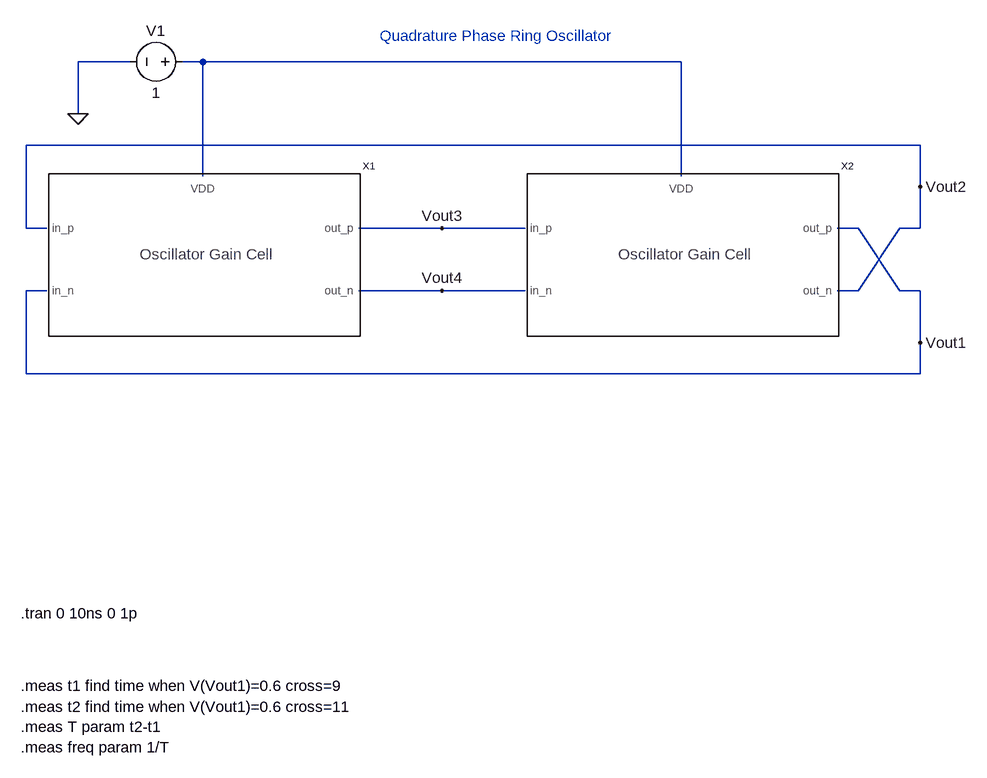
[diagram p0: schematic quadrature_phase_ring_oscillator.asc]
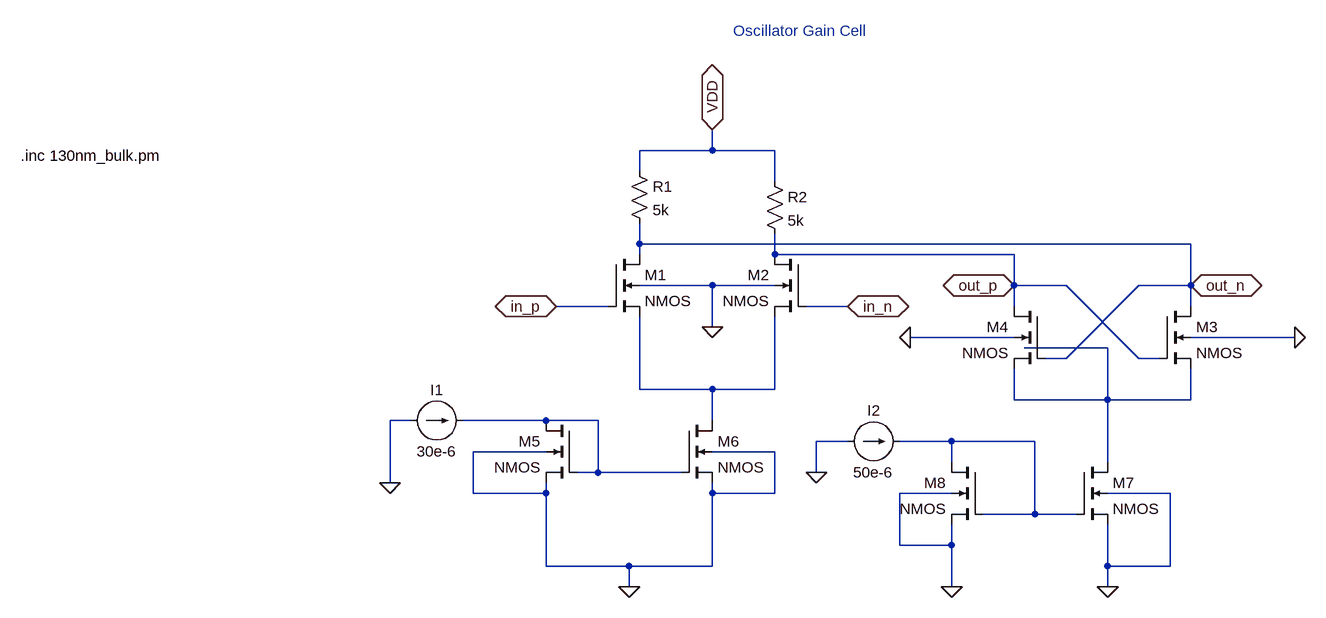
[diagram p1: sub-circuit osc_gain_cell.asc]
quadrature_phase_ring_oscillator.asc, the LTspice schematic file:
Version 4
SHEET 1 1172 1032
WIRE -96 -32 -176 -32
WIRE 16 -32 -16 -32
WIRE 752 -32 16 -32
WIRE -176 48 -176 -32
WIRE 1120 96 -256 96
WIRE 16 144 16 -32
WIRE 752 144 752 -32
WIRE 1120 160 1120 96
WIRE -256 224 -256 96
WIRE -224 224 -256 224
WIRE 384 224 256 224
WIRE 512 224 384 224
WIRE 1024 224 992 224
WIRE 1120 224 1120 160
WIRE 1120 224 1088 224
WIRE -224 320 -256 320
WIRE 384 320 256 320
WIRE 512 320 384 320
WIRE 1024 320 1088 224
WIRE 1024 320 992 320
WIRE 1088 320 1024 224
WIRE 1120 320 1088 320
WIRE 1120 400 1120 320
WIRE -256 448 -256 320
WIRE 1120 448 1120 400
WIRE 1120 448 -256 448
FLAG -176 48 0
FLAG 384 224 Vout3
FLAG 384 320 Vout4
FLAG 1120 400 Vout1
FLAG 1120 160 Vout2
SYMBOL osc_gain_cell -288 208 R0
SYMATTR InstName X1
SYMBOL osc_gain_cell 448 208 R0
SYMATTR InstName X2
SYMBOL voltage 0 -32 R90
WINDOW 0 -32 56 VBottom 2
WINDOW 3 32 56 VTop 2
SYMATTR InstName V1
SYMATTR Value 1
TEXT -264 816 Left 2 !.tran 0 10ns 0 1p
TEXT -264 928 Left 2 !.meas t1 find time when V(Vout1)=0.6 cross=9
TEXT -264 960 Left 2 !.meas t2 find time when V(Vout1)=0.6 cross=11\n.meas T param t2-t1\n.meas freq param 1/T
TEXT 288 -72 Left 2 ;Quadrature Phase Ring Oscillator

osc_gain_cell.asc, the sub-circuit schematic file:
Version 4
SHEET 1 1220 884
WIRE 224 -96 224 -128
WIRE 224 -96 112 -96
WIRE 320 -96 224 -96
WIRE 112 -64 112 -96
WIRE 320 -48 320 -96
WIRE 112 48 112 16
WIRE 960 48 112 48
WIRE 112 64 112 48
WIRE 320 64 320 32
WIRE 688 64 320 64
WIRE 224 112 112 112
WIRE 320 112 224 112
WIRE 688 112 688 64
WIRE 768 112 688 112
WIRE 960 112 960 48
WIRE 960 112 880 112
WIRE 64 144 -16 144
WIRE 432 144 368 144
WIRE 688 144 688 112
WIRE 960 144 960 112
WIRE 224 176 224 112
WIRE 688 192 528 192
WIRE 1120 192 960 192
WIRE 832 208 704 208
WIRE 768 224 880 112
WIRE 768 224 736 224
WIRE 880 224 768 112
WIRE 912 224 880 224
WIRE 112 272 112 160
WIRE 224 272 112 272
WIRE 320 272 320 160
WIRE 320 272 224 272
WIRE 688 288 688 240
WIRE 832 288 832 208
WIRE 832 288 688 288
WIRE 960 288 960 240
WIRE 960 288 832 288
WIRE -240 320 -272 320
WIRE -32 320 -160 320
WIRE 48 320 -32 320
WIRE 224 320 224 272
WIRE 432 352 384 352
WIRE 592 352 512 352
WIRE 720 352 592 352
WIRE -32 368 -144 368
WIRE 320 368 224 368
WIRE 592 384 592 352
WIRE 832 384 832 288
WIRE 48 400 48 320
WIRE 48 400 16 400
WIRE 176 400 48 400
WIRE 384 400 384 352
WIRE -272 416 -272 320
WIRE -144 432 -144 368
WIRE -32 432 -32 416
WIRE -32 432 -144 432
WIRE 224 432 224 416
WIRE 320 432 320 368
WIRE 320 432 224 432
WIRE 592 432 512 432
WIRE 928 432 832 432
WIRE 720 464 720 352
WIRE 720 464 640 464
WIRE 784 464 720 464
WIRE 512 512 512 432
WIRE 592 512 592 480
WIRE 592 512 512 512
WIRE -32 544 -32 432
WIRE 96 544 -32 544
WIRE 224 544 224 432
WIRE 224 544 96 544
WIRE 832 544 832 480
WIRE 928 544 928 432
WIRE 928 544 832 544
WIRE 96 576 96 544
WIRE 592 576 592 512
WIRE 832 576 832 544
FLAG 224 176 0
FLAG 224 -128 VDD
IOPIN 224 -128 BiDir
FLAG -16 144 in_p
IOPIN -16 144 BiDir
FLAG 432 144 in_n
IOPIN 432 144 BiDir
FLAG 96 576 0
FLAG -272 416 0
FLAG 384 400 0
FLAG 592 576 0
FLAG 832 576 0
FLAG 688 112 out_p
IOPIN 688 112 BiDir
FLAG 960 112 out_n
IOPIN 960 112 BiDir
FLAG 1120 192 0
FLAG 528 192 0
SYMBOL nmos4 64 64 R0
SYMATTR InstName M1
SYMATTR Value2 l=130n w=2u
SYMBOL nmos4 368 64 M0
SYMATTR InstName M2
SYMATTR Value2 l=130n w=2u
SYMBOL nmos4 16 320 M0
SYMATTR InstName M5
SYMATTR Value2 l=400n w=2u
SYMBOL nmos4 176 320 R0
SYMATTR InstName M6
SYMATTR Value2 l=400n w=6u
SYMBOL nmos4 736 144 M0
SYMATTR InstName M4
SYMATTR Value2 l=130n w=2u
SYMBOL nmos4 912 144 R0
SYMATTR InstName M3
SYMATTR Value2 l=130n w=2u
SYMBOL nmos4 640 384 M0
SYMATTR InstName M8
SYMATTR Value2 l=400n w=2u
SYMBOL nmos4 784 384 R0
SYMATTR InstName M7
SYMATTR Value2 l=400n w=6u
SYMBOL res 96 -80 R0
SYMATTR InstName R1
SYMATTR Value 5k
SYMBOL res 304 -64 R0
SYMATTR InstName R2
SYMATTR Value 5k
SYMBOL current -240 320 M90
WINDOW 0 -32 40 VBottom 2
WINDOW 3 32 40 VTop 2
WINDOW 123 0 0 Left 0
WINDOW 39 0 0 Left 0
SYMATTR InstName I1
SYMATTR Value 30e-6
SYMBOL current 432 352 M90
WINDOW 0 -32 40 VBottom 2
WINDOW 3 32 40 VTop 2
SYMATTR InstName I2
SYMATTR Value 50e-6
TEXT -840 -88 Left 2 !.inc 130nm_bulk.pm
TEXT 256 -280 Left 2 ;Oscillator Gain Cell

The netlist it stands for:
* quadrature_phase_ring_oscillator.asc
XX1 N001 Vout2 Vout1 Vout3 Vout4 osc_gain_cell
XX2 N001 Vout3 Vout4 Vout1 Vout2 osc_gain_cell
V1 N001 0 1

* block symbol definitions
.subckt osc_gain_cell VDD in_p in_n out_p out_n
M1 out_n in_p N002 0 NMOS l=130n w=2u
M2 out_p in_n N002 0 NMOS l=130n w=2u
M5 N003 N003 0 0 NMOS l=400n w=2u
M6 N002 N003 0 0 NMOS l=400n w=6u
M4 out_p out_n N001 0 NMOS l=130n w=2u
M3 out_n out_p N001 0 NMOS l=130n w=2u
M8 N004 N004 0 0 NMOS l=400n w=2u
M7 N001 N004 0 0 NMOS l=400n w=6u
R1 VDD out_n 5k
R2 VDD out_p 5k
I1 0 N003 30e-6
I2 0 N004 50e-6
.inc 130nm_bulk.pm
* Oscillator Gain Cell
.ends osc_gain_cell

.model NMOS NMOS
.model PMOS PMOS
.lib standard.mos
.tran 0 10ns 0 1p
.meas t1 find time when V(Vout1)=0.6 cross=9
.meas t2 find time when V(Vout1)=0.6 cross=11
.meas T param t2-t1
.meas freq param 1/T
* Quadrature Phase Ring Oscillator
.backanno
.end